# Altium schematic sheet Mouse_Receive_SCH.SchDoc
size A3
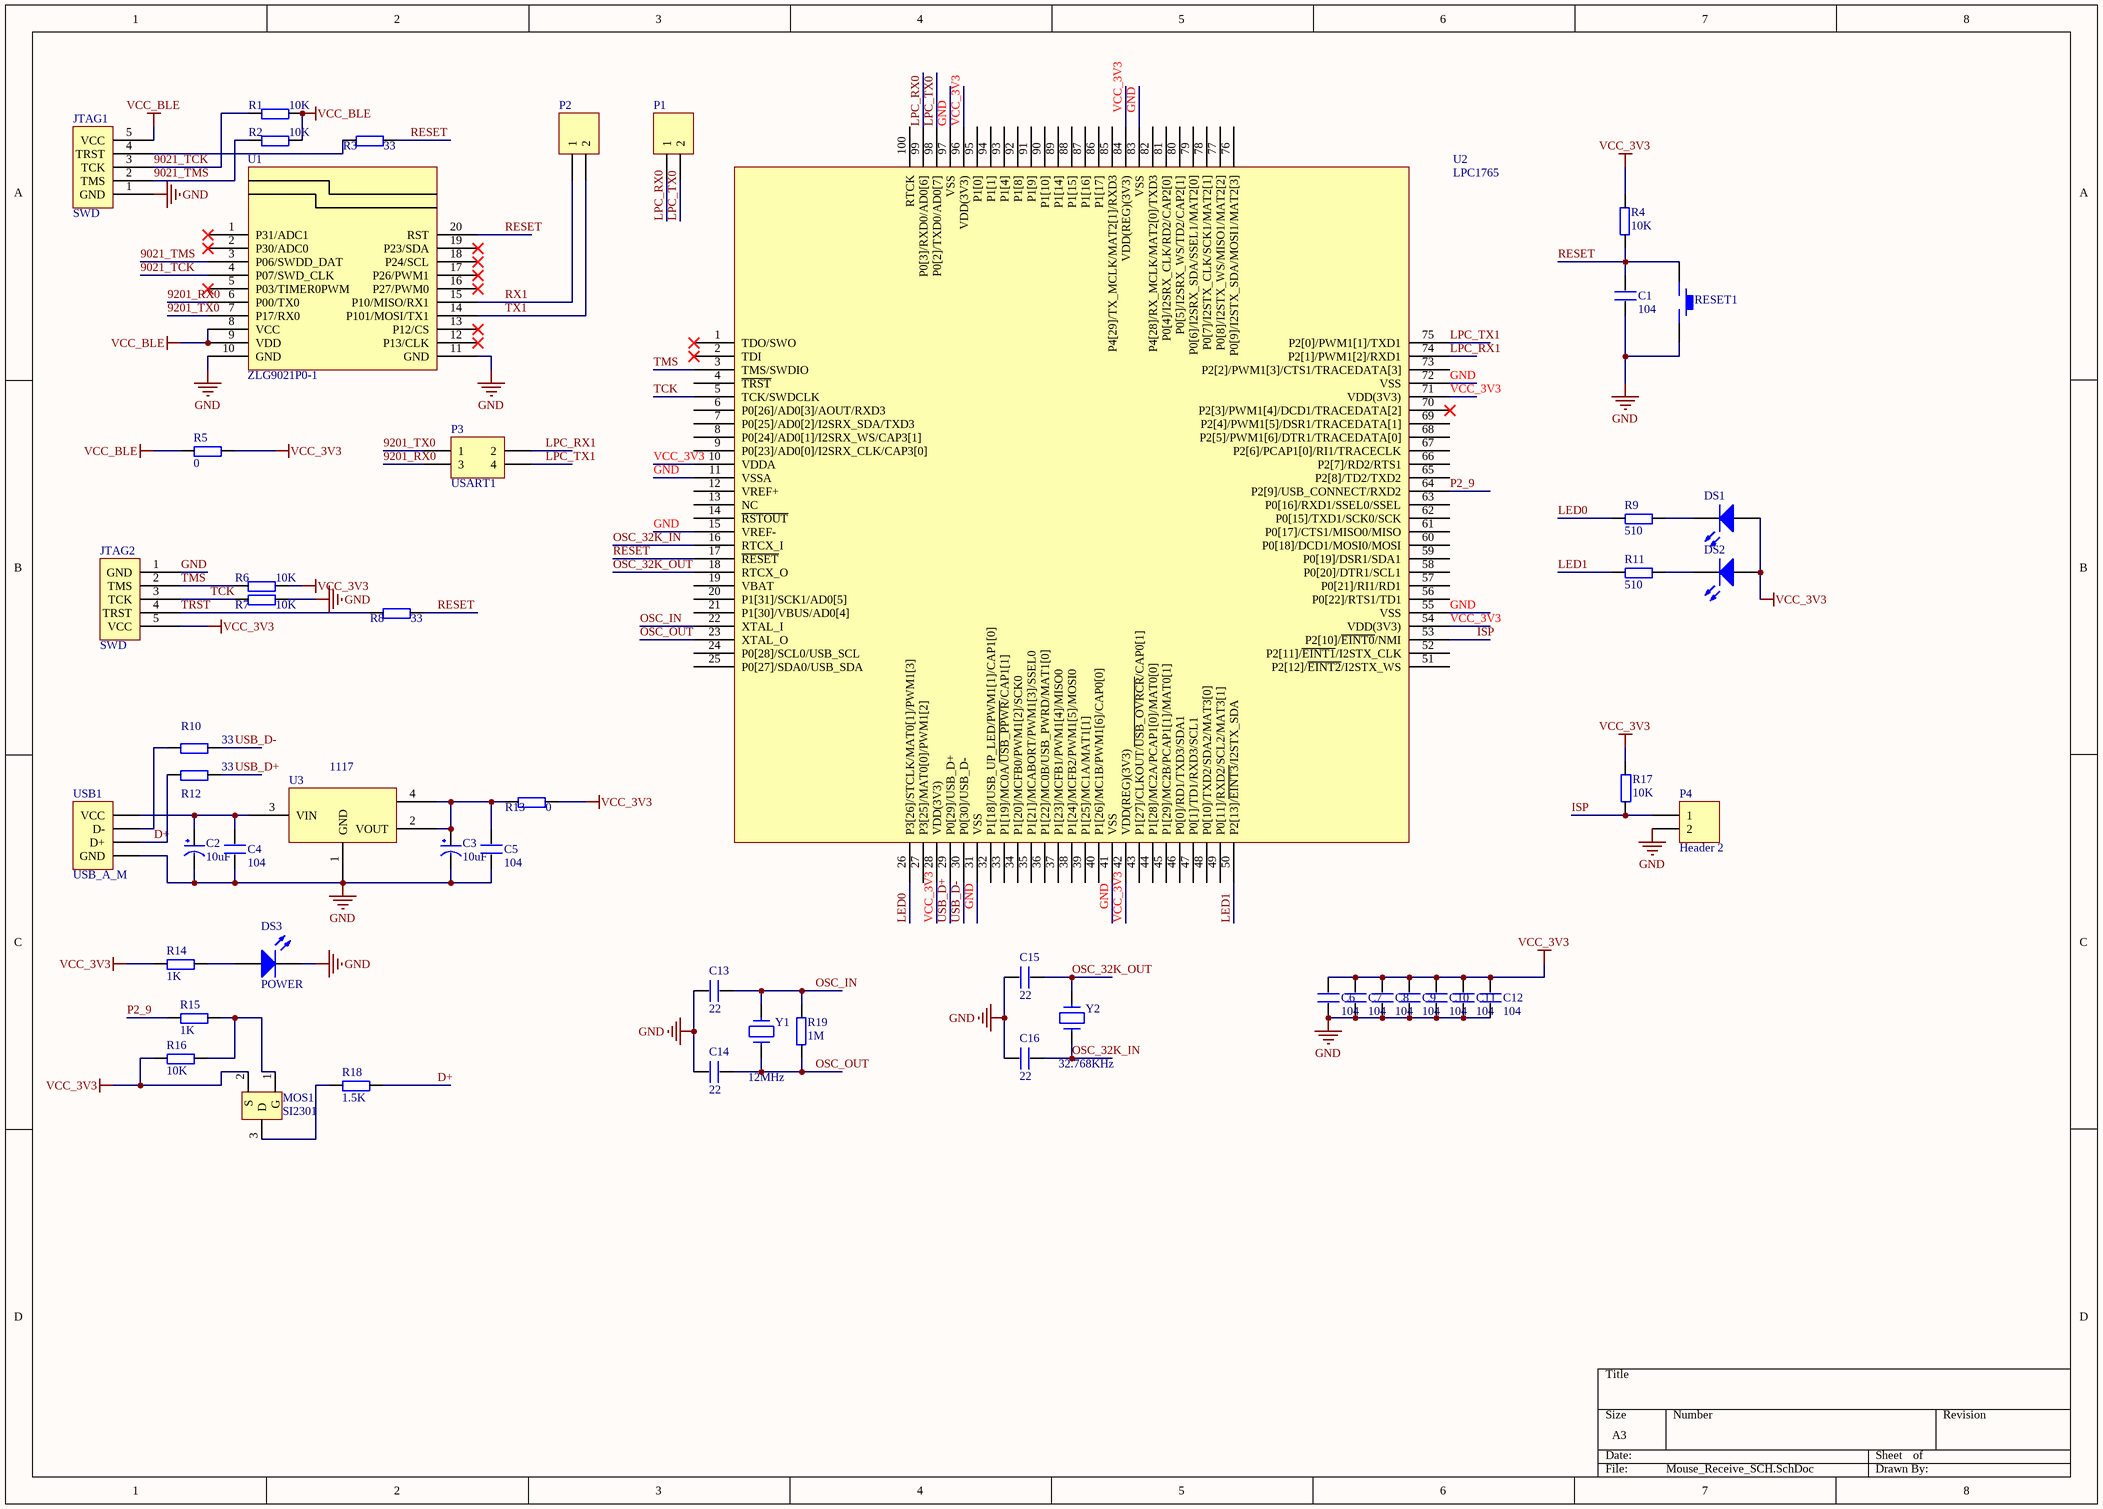
[diagram p0: Mouse_Receive_SCH.SchDoc]

## Parts
C1  104  [0603P]
C2  10uF  [TAJ_A]
C3  10uF  [TAJ_A]
C4  104  [0603P]
C5  104  [0603P]
C6  104  [0603P]
C7  104  [0603P]
C8  104  [0603P]
C9  104  [0603P]
C10  104  [0603P]
C11  104  [0603P]
C12  104  [0603P]
C13  22  [0603P]
C14  22  [0603P]
C15  22  [0603P]
C16  22  [0603P]
DS1  (no value)  [SMDLED]
DS2  (no value)  [SMDLED]
DS3  POWER  [SMDLED]
JTAG1  SWD  [HEAD5]
JTAG2  SWD  [HEAD5]
MOS1  SI2301  [SOT-23]
P1  (no value)  [HDR1X2]
P2  (no value)  [HDR1X2]
P3  USART1  [HDR2X2]
P4  Header 2  [HDR1X2]
R1  10K  [0603P]
R2  10K  [0603P]
R3  33  [0603P]
R4  10K  [0603P]
R5  0  [0603P]
R6  10K  [0603P]
R7  10K  [0603P]
R8  33  [0603P]
R9  510  [0603P]
R10  33  [0603P]
R11  510  [0603P]
R12  33  [0603P]
R13  0  [0603P]
R14  1K  [0603P]
R15  1K  [0603P]
R16  10K  [0603P]
R17  10K  [0603P]
R18  1.5K  [0603P]
R19  1M  [0603P]
RESET1  KEY_M  [KEY2]  (value not drawn)
U1  ZLG9021P0-1  [ZLG9021P0-1]
U2  LPC1765  [TQFP-100]
U3  1117  [AMS1117]
USB1  USB_A_M  [USB-4-A-SMT-A]
Y1  12MHz  [8M]
Y2  32.768KHz  [CRY-32]

## Nets
GND: C1.1 C2.2(GND) C3.2(GND) C4.1 C5.1 C6.2 C7.2 C8.2 C9.2 C10.2 C11.2 C12.2 C13.1 C14.1 C15.1 C16.1 DS3.2(K) JTAG1.1(GND) JTAG2.1(GND) P4.2 R7.2 RESET1.1 U1.10(GND) U1.11(GND) U2.11(VSSA) U2.15(VREF-) U2.31(VSS) U2.41(VSS) U2.55(VSS) U2.72(VSS) U2.83(VSS) U2.97(VSS) U3.1(GND) USB1.4(GND)
VCC_3V3: C6.1 C7.1 C8.1 C9.1 C10.1 C11.1 C12.1 DS1.1(A) DS2.1(A) JTAG2.5(VCC) MOS1.2(S) R4.2 R5.2 R6.2 R13.2 R14.1 R16.1 R17.2 U2.10(VDDA) U2.28(VDD(3V3)) U2.42(VDD(REG)(3V3)) U2.54(VDD(3V3)) U2.71(VDD(3V3)) U2.84(VDD(REG)(3V3)) U2.96(VDD(3V3))
VCC_BLE: JTAG1.5(VCC) R1.2 R2.2 R5.1 U1.8(VCC) U1.9(VDD)
9021_TCK: JTAG1.3(TCK) R1.1 U1.4(P07/SWD_CLK)
9021_TMS: JTAG1.2(TMS) R2.1 U1.3(P06/SWDD_DAT)
9201_RX0: P3.3 U1.6(P00/TX0)
9201_TX0: P3.1 U1.7(P17/RX0)
D+: R12.1 R18.2 USB1.3(D+)
ISP: P4.1 R17.1 U2.53(P2[10]/~{EINT0}/NMI)
LED0: R9.1 U2.26(P3[26]/STCLK/MAT0[1]/PWM1[3])
LED1: R11.1 U2.50(P2[13]/~{EINT3}/I2STX_SDA)
LPC_RX0: P1.1 U2.99(P0[3]/RXD0/AD0[6])
LPC_RX1: P3.2 U2.74(P2[1]/PWM1[2]/RXD1)
LPC_TX0: P1.2 U2.98(P0[2]/TXD0/AD0[7])
LPC_TX1: P3.4 U2.75(P2[0]/PWM1[1]/TXD1)
OSC_32K_IN: C16.2 U2.16(RTCX_I) Y2.1
OSC_32K_OUT: C15.2 U2.18(RTCX_O) Y2.2
OSC_IN: C13.2 R19.1 U2.22(XTAL_I) Y1.2
OSC_OUT: C14.2 R19.2 U2.23(XTAL_O) Y1.1
P2_9: R15.1 U2.64(P2[9]/USB_CONNECT/RXD2)
RESET: C1.2 R3.2 R4.1 R8.2 RESET1.2 U1.20(RST) U2.17(~{RESET})
RX1: P2.1 U1.15(P10/MISO/RX1)
TCK: JTAG2.3(TCK) R7.1 U2.5(TCK/SWDCLK)
TMS: JTAG2.2(TMS) R6.1 U2.3(TMS/SWDIO)
TRST: JTAG2.4(TRST) R8.1
TX1: P2.2 U1.14(P101/MOSI/TX1)
USB_D+: R12.2 U2.29(P0[29]/USB_D+)
USB_D-: R10.2 U2.30(P0[30]/USB_D-)
NetC2_1: C2.1(VCC) C4.2 U3.3(VIN) USB1.1(VCC)
NetC3_1: C3.1(VCC) C5.2 R13.1 U3.2(VOUT) U3.4
NetDS1_2: DS1.2(K) R9.2
NetDS2_2: DS2.2(K) R11.2
NetDS3_1: DS3.1(A) R14.2
NetJTAG1_4: JTAG1.4(TRST) R3.1
NetMOS1_1: MOS1.1(G) R15.2 R16.2
NetMOS1_3: MOS1.3(D) R18.1
NetR10_1: R10.1 USB1.2(D-)

Not connected (* = marked no-connect by the designer): U1 1(P31/ADC1)* 2(P30/ADC0)* 5(P03/TIMER0PWM)* 12(P13/CLK)* 13(P12/CS)* 16(P27/PWM0)* 17(P26/PWM1)* 18(P24/SCL)* 19(P23/SDA)*; U2 1(TDO/SWO)* 2(TDI)* 4(~{TRST}) 6(P0[26]/AD0[3]/AOUT/RXD3) 7(P0[25]/AD0[2]/I2SRX_SDA/TXD3) 8(P0[24]/AD0[1]/I2SRX_WS/CAP3[1]) 9(P0[23]/AD0[0]/I2SRX_CLK/CAP3[0]) 12(VREF+) 13(NC) 14(~{RSTOUT}) 19(VBAT) 20(P1[31]/SCK1/AD0[5]) 21(P1[30]/VBUS/AD0[4]) 24(P0[28]/SCL0/USB_SCL) 25(P0[27]/SDA0/USB_SDA) 27(P3[25]/MAT0[0]/PWM1[2]) 32(P1[18]/USB_UP_LED/PWM1[1]/CAP1[0]) 33(P1[19]/MC0A/~{USB_PPWR}/CAP1[1]) 34(P1[20]/MCFB0/PWM1[2]/SCK0) 35(P1[21]/MCABORT/PWM1[3]/SSEL0) 36(P1[22]/MC0B/USB_PWRD/MAT1[0]) 37(P1[23]/MCFB1/PWM1[4]/MISO0) 38(P1[24]/MCFB2/PWM1[5]/MOSI0) 39(P1[25]/MC1A/MAT1[1]) 40(P1[26]/MC1B/PWM1[6]/CAP0[0]) 43(P1[27]/CLKOUT/~{USB_OVRCR}/CAP0[1]) 44(P1[28]/MC2A/PCAP1[0]/MAT0[0]) 45(P1[29]/MC2B/PCAP1[1]/MAT0[1]) 46(P0[0]/RD1/TXD3/SDA1) 47(P0[1]/TD1/RXD3/SCL1) 48(P0[10]/TXD2/SDA2/MAT3[0]) 49(P0[11]/RXD2/SCL2/MAT3[1]) 51(P2[12]/~{EINT2}/I2STX_WS) 52(P2[11]/~{EINT1}/I2STX_CLK) 56(P0[22]/RTS1/TD1) 57(P0[21]/RI1/RD1) 58(P0[20]/DTR1/SCL1) 59(P0[19]/DSR1/SDA1) 60(P0[18]/DCD1/MOSI0/MOSI) 61(P0[17]/CTS1/MISO0/MISO) 62(P0[15]/TXD1/SCK0/SCK) 63(P0[16]/RXD1/SSEL0/SSEL) 65(P2[8]/TD2/TXD2) 66(P2[7]/RD2/RTS1) 67(P2[6]/PCAP1[0]/RI1/TRACECLK) 68(P2[5]/PWM1[6]/DTR1/TRACEDATA[0]) 69(P2[4]/PWM1[5]/DSR1/TRACEDATA[1]) 70(P2[3]/PWM1[4]/DCD1/TRACEDATA[2])* 73(P2[2]/PWM1[3]/CTS1/TRACEDATA[3]) 76(P0[9]/I2STX_SDA/MOSI1/MAT2[3]) 77(P0[8]/I2STX_WS/MISO1/MAT2[2]) 78(P0[7]/I2STX_CLK/SCK1/MAT2[1]) 79(P0[6]/I2SRX_SDA/SSEL1/MAT2[0]) 80(P0[5]/I2SRX_WS/TD2/CAP2[1]) 81(P0[4]/I2SRX_CLK/RD2/CAP2[0]) 82(P4[28]/RX_MCLK/MAT2[0]/TXD3) 85(P4[29]/TX_MCLK/MAT2[1]/RXD3) 86(P1[17]) 87(P1[16]) 88(P1[15]) 89(P1[14]) 90(P1[10]) 91(P1[9]) 92(P1[8]) 93(P1[4]) 94(P1[1]) 95(P1[0]) 100(RTCK)

## Library data of the parts
C1 C4-C16 = C
C2 C3 = CAP
DS1-DS3 = LED2: Typical RED, GREEN, YELLOW, AMBER GaAs LED; Published: 8-Jun-2000; LatestRevisionDate: 17-Jul-2002; LatestRevisionNote: Re-released for DXP Platform.; PackageDocument: Feb-2002; PackageReference: 3.2X1.6X1.1; Publisher: Altium Limited
MOS1 = MOS-P: IRLML6401/SI2301
P1 P2 = Header 2: LatestRevisionDate: 17-Jul-2002; LatestRevisionNote: Re-released for DXP Platform.; Publisher: Altium Limited
P3 = Header 2X2: Header, 2-Pin, Dual row; LatestRevisionDate: 17-Jul-2002; LatestRevisionNote: Re-released for DXP Platform.; Publisher: Altium Limited
R1-R19 = R
Y1 Y2 = CRYSTAL
P4 = Header 2: LatestRevisionDate: 17-Jul-2002; LatestRevisionNote: Re-released for DXP Platform.; Publisher: Altium Limited